# EAGLE design DRV10987 (EAGLE 8.7.1)
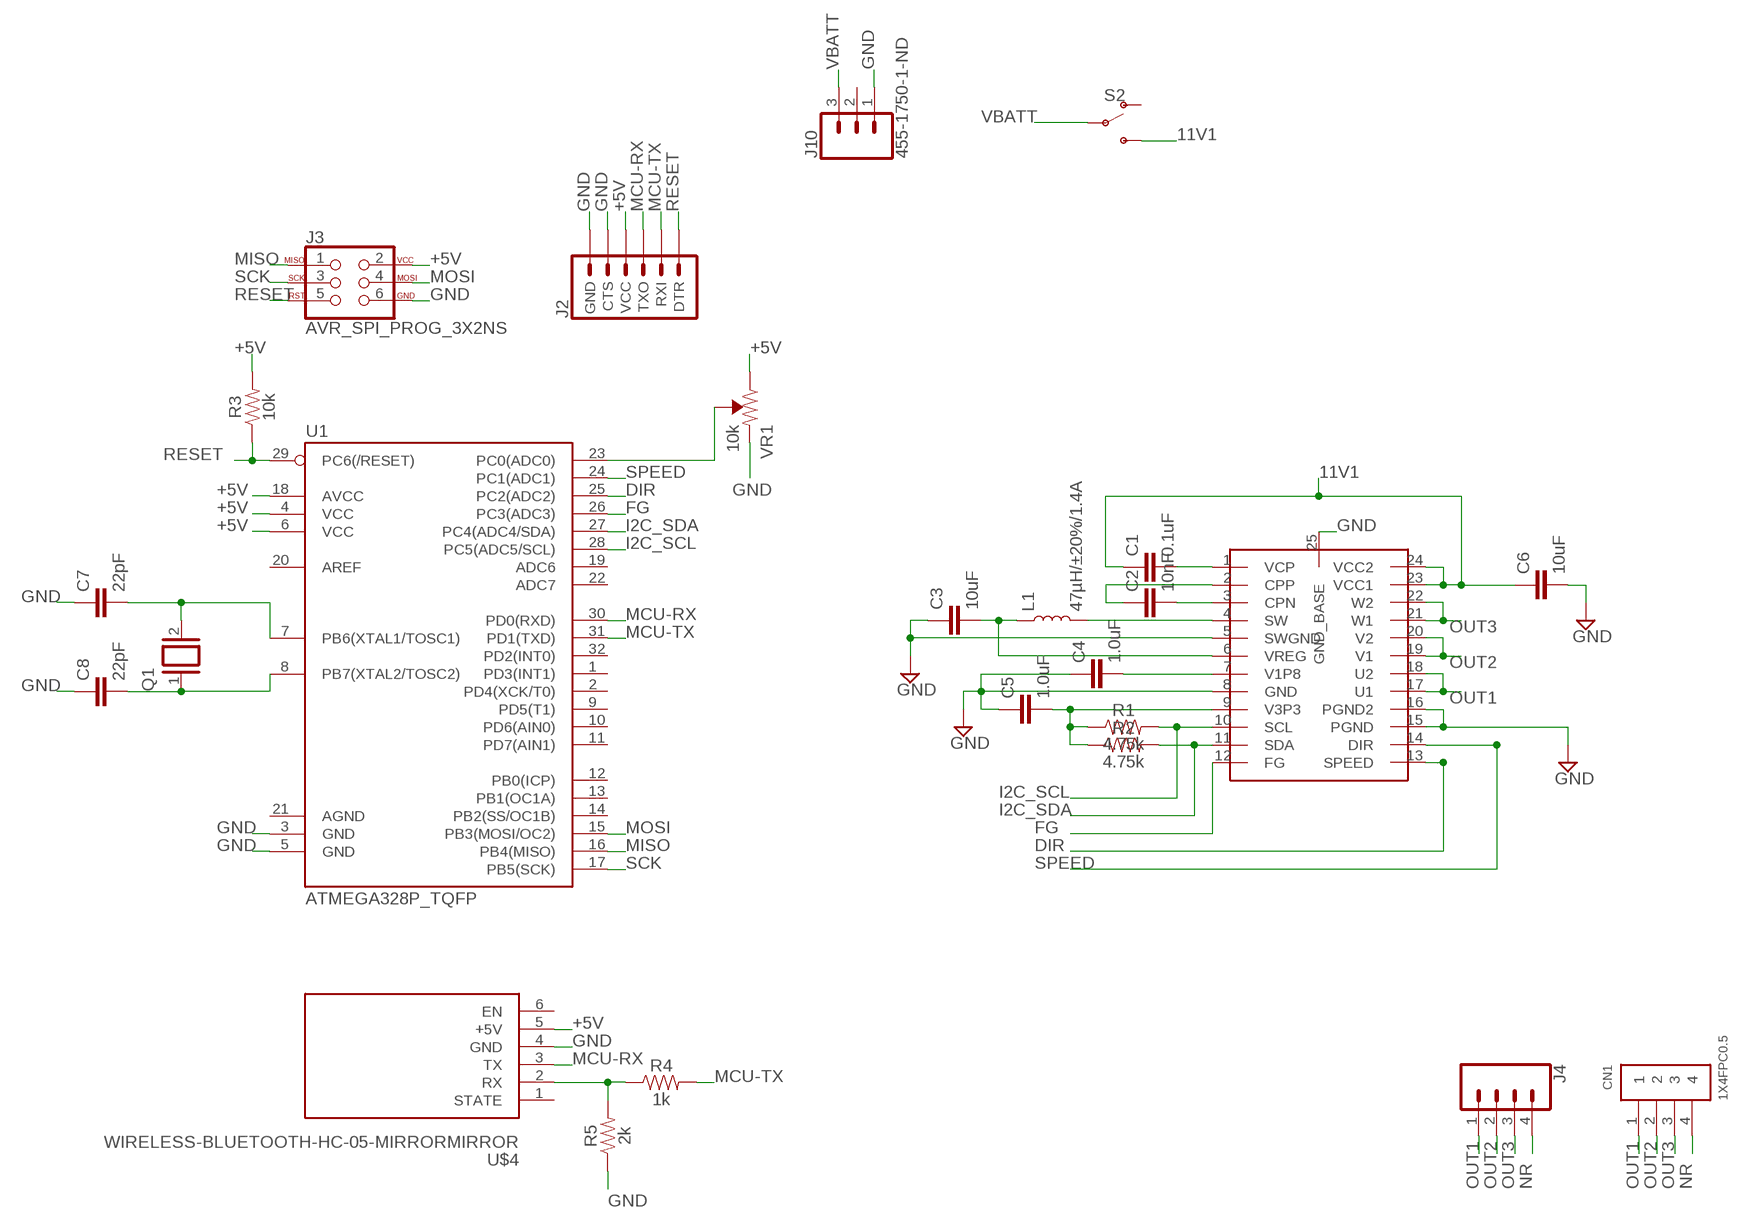
[diagram p0: schematic, sheet 1]

## Parts
C1  0.1uF  1.0UF-0805-25V-10%  [0805]
C2  10nF  1.0UF-0805-25V-10%  [0805]
C3  10uF  1.0UF-0805-25V-10%  [0805]
C4  1.0uF  1.0UF-0805-25V-10%  [0805]
C5  1.0uF  1.0UF-0805-25V-10%  [0805]
C6  10uF  1.0UF-0805-25V-10%  [0805]
C7  22pF  2.2UF-1206-50V-10%  [1206]
C8  22pF  2.2UF-1206-50V-10%  [1206]
CN1  1X4FPC0.5  [FPC_0.5MM-4]
J2  6_PIN_SERIAL_TARGET  [1X06]
J3  AVR_SPI_PROG_3X2NS  [2X3-NS]
J4  CONN_04  [1X04]
J10  455-1750-1-ND  CONN_03  [1X03]
L1  47µH/±20%/1.4A  INDUCTOR-SRN6045-33UH  [SRN6045]
Q1  XTAL/S  [QS]
R1  4.75k  RESISTOR0805  [0805]
R2  4.75k  RESISTOR0805  [0805]
R3  10k  RESISTOR1206  [1206]
R4  1k  1KOHM-HORIZ-1/4W-5%  [AXIAL-0.3]
R5  2k  RESISTORAXIAL-0.3  [AXIAL-0.3]
S2  SWITCH-SPDT-PTH-11.6X4.0MM  [SWITCH_SPDT_PTH_11.6X4.0MM]
U1  ATMEGA328P_TQFP  [TQFP32-08]
U$1  DRV10987  [DRV10987]
U$4  WIRELESS-BLUETOOTH-HC-05-MIRRORMIRROR  [WIRELESS-BLUETOOTH-HC-05-MIRROR]
VR1  10k  TRIMPOT-PTH-10MM-KNOB-1/2W-10%  [TRIMPOT-PTH-3386U]

## Nets
11V1: C1.1 C6.1 S2.3(S) U$1.23(VCC1) U$1.24(VCC2)
+5V: J2.4(VCC) J3.2 R3.2 U1.4(VCC) U1.6(VCC) U1.18(AVCC) U$4.5(+5V) VR1.3(CW)
DIR: U1.25(PC2(ADC2)) U$1.13(SPEED)
FG: U1.26(PC3(ADC3)) U$1.12(FG)
GND: C3.1 C4.1 C5.1 C6.2 C7.1 C8.1 J2.5(CTS) J2.6(GND) J3.6 J10.1 R5.P$1 U1.3(GND) U1.5(GND) U$1.5(SWGND) U$1.8(GND) U$1.15(PGND) U$1.16(PGND2) U$1.25(GND_BASE) U$4.4(GND) VR1.1(CCW)
I2C_SCL: R1.2 U1.28(PC5(ADC5/SCL)) U$1.10(SCL)
I2C_SDA: R2.2 U1.27(PC4(ADC4/SDA)) U$1.11(SDA)
MCU-RX: J2.3(TXO) U1.30(PD0(RXD)) U$4.3(TX)
MCU-TX: J2.2(RXI) R4.P$2 U1.31(PD1(TXD))
MISO: J3.1 U1.16(PB4(MISO))
MOSI: J3.4 U1.15(PB3(MOSI/OC2))
N$1: C1.2 U$1.1(VCP)
N$2: C2.1 U$1.2(CPP)
N$3: C2.2 U$1.3(CPN)
N$4: L1.2 U$1.4(SW)
N$6: C3.2 L1.1 U$1.6(VREG)
N$7: C4.2 U$1.7(V1P8)
N$8: C7.2 Q1.2 U1.7(PB6(XTAL1/TOSC1))
N$9: C5.2 R1.1 R2.1 U$1.9(V3P3)
N$10: C8.2 Q1.1 U1.8(PB7(XTAL2/TOSC2))
N$13: R4.P$1 R5.P$2 U$4.2(RX)
N$14: U1.23(PC0(ADC0)) VR1.2(WIPER)
NR: CN1.4 J4.4
OUT1: CN1.1 J4.1 U$1.17(U1) U$1.18(U2)
OUT2: CN1.2 J4.2 U$1.19(V1) U$1.20(V2)
OUT3: CN1.3 J4.3 U$1.21(W1) U$1.22(W2)
RESET: J2.1(DTR) J3.5 R3.1 U1.29(PC6(/RESET))
SCK: J3.3 U1.17(PB5(SCK))
SPEED: U1.24(PC1(ADC1)) U$1.14(DIR)
VBATT: J10.3 S2.2(P)
Unconnected: J10.2 S2.1(O) U1.1(PD3(INT1)) U1.2(PD4(XCK/T0)) U1.9(PD5(T1)) U1.10(PD6(AIN0)) U1.11(PD7(AIN1)) U1.12(PB0(ICP)) U1.13(PB1(OC1A)) U1.14(PB2(SS/OC1B)) U1.19(ADC6) U1.20(AREF) U1.21(AGND) U1.22(ADC7) U1.32(PD2(INT0)) U$4.1(STATE) U$4.6(EN)

## Library data of the parts
C1-C3 C6 = SparkFun-Capacitors:1.0UF: 1µF ceramic capacitors A capacitor is a passive two-terminal electrical component used to store electrical energy temporarily in an electric field.; PROD_ID: CAP-08064; VALUE: 1.0uF
C4 C5 = SparkFun-Capacitors:1.0UF: 1µF ceramic capacitors A capacitor is a passive two-terminal electrical component used to store electrical energy temporarily in an electric field.; PROD_ID: CAP-08064
C7 C8 = SparkFun-Capacitors:2.2UF: 2.2µF ceramic capacitors A capacitor is a passive two-terminal electrical component used to store electrical energy temporarily in an electric field.; PROD_ID: CAP-10009; VALUE: 2.2uF
CN1 = adafruit:1X4: 4-pin connector
J2 = SparkFun-Connectors:6_PIN_SERIAL_TARGET: 6-pin header connection for use with the "FTDI BASIC" pinout - TARGET SIDE. Also known as "Arduino Serial Program Header". It is used to mate with our FTDI Basic serial programmers using the Arduino IDE. Note, this device has "TARGET" in the name. It is intended to be used on a design that contains a target micro-controller that you wish to program. The "sister" device, named "CABLE" is inteneded to be used on a design that usually lives on the end of your USB cable and prvides the converter chip (FTDI232 or FTDI231x) to commnicate serial RX/TX. You can populate with some of these: Break Away Headers - Straight <https://www.sparkfun.com/products/116> (PRT-00116) For reference (or to suit your programming needs) check out these designs: SparkFun FTDI Basic Breakout - 5V <https://www.sparkfun.com/products/9716> (DEV-09716) SparkFun FTDI Basic Breakout - 3.3V <https://www.sparkfun.com/products/9873> (DEV-09873) SparkFun FTDI SmartBasic <https://www.sparkfun.com/products/12935> (DEV-12935) SparkFun Beefy 3 - FTDI Basic Breakout <https://www.sparkfun.com/products/13746> (DEV-13746)
J3 = SparkFun-Connectors:AVR_SPI_PROG_3X2: AVR ISP 6 Pin This is the reduced ISP connector for AVR programming. Common on Arduino. This footprint will take up less PCB space and can be used with a 10-pin to 6-pin adapter such as SKU: BOB-08508 **Special note about "TEST_POINT" package. The stop mask is on the top side, so if you want your programming test points to be on the bottom of your board, make sure to place this package on the bottom side of the board. This also ensure that the orientation to program from the bottom side will be correct. SparkFun Products: SparkFun ISP Pogo Adapter <https://www.sparkfun.com/products/11591> - NS Tiny AVR Programmer <https://www.sparkfun.com/products/11801> -PTH
J4 = SparkFun-Connectors:CONN_04: Multi connection point. Often used as Generic Header-pin footprint for 0.1 inch spaced/style header connections On any of the 0.1 inch spaced packages, you can populate with these: Break Away Headers - Straight <https://www.sparkfun.com/products/116> (PRT-00116) Break Away Male Headers - Right Angle <https://www.sparkfun.com/products/553> (PRT-00553) Female Headers <https://www.sparkfun.com/products/115> (PRT-00115) Break Away Headers - Machine Pin <https://www.sparkfun.com/products/117> (PRT-00117) Break Away Female Headers - Swiss Machine Pin <https://www.sparkfun.com/products/743> (PRT-00743) For SCREWTERMINALS and SPRING TERMINALS visit here: Screw Terimnals on SparkFun.com <https://www.sparkfun.com/search/results?term=Screw+Terminals> (5mm/3.5mm/2.54mm spacing) This device is also useful as a general connection point to wire up your design to another part of your project. Our various solder wires solder well into these plated through hole pads. Hook-Up Wire - Assortment (Stranded, 22 AWG) <https://www.sparkfun.com/products/11375> (PRT-11375) Hook-Up Wire - Assortment (Solid Core, 22 AWG) <https://www.sparkfun.com/products/11367> (PRT-11367) View the entire wire category on our website here <https://www.sparkfun.com/categories/141> Special notes: Molex polarized connector foot print use with SKU : PRT-08231 with associated crimp pins and housings. 1MM SMD Version SKU: PRT-10208; PROD_ID: CONN-09696
J10 = SparkFun-Connectors:CONN_03: Multi connection point. Often used as Generic Header-pin footprint for 0.1 inch spaced/style header connections On any of the 0.1 inch spaced packages, you can populate with these: Break Away Headers - Straight <https://www.sparkfun.com/products/116> (PRT-00116) Break Away Male Headers - Right Angle <https://www.sparkfun.com/products/553> (PRT-00553) Female Headers <https://www.sparkfun.com/products/115> (PRT-00115) Break Away Headers - Machine Pin <https://www.sparkfun.com/products/117> (PRT-00117) Break Away Female Headers - Swiss Machine Pin <https://www.sparkfun.com/products/743> (PRT-00743) Stackable Header - 3 Pin (Female, 0.1") <https://www.sparkfun.com/products/13875> (PRT-13875) For SCREWTERMINALS and SPRING TERMINALS visit here: Screw Terimnals on SparkFun.com <https://www.sparkfun.com/search/results?term=Screw+Terminals> (5mm/3.5mm/2.54mm spacing) This device is also useful as a general connection point to wire up your design to another part of your project. Our various solder wires solder well into these plated through hole pads. Hook-Up Wire - Assortment (Stranded, 22 AWG) <https://www.sparkfun.com/products/11375> (PRT-11375) Hook-Up Wire - Assortment (Solid Core, 22 AWG) <https://www.sparkfun.com/products/11367> (PRT-11367) View the entire wire category on our website here <https://www.sparkfun.com/categories/141> Special notes: Molex polarized connector foot print use with SKU : PRT-08232 with associated crimp pins and housings.; PROD_ID: XXX-00000
L1 = SparkFun-Coils:INDUCTOR: Inductors Resist changes in electrical current. Basically a coil of wire. SparkFun Products: SparkFun Load Cell Amplifier - HX711 <https://www.sparkfun.com/products/13879> IOIO-OTG - V2.2 <https://www.sparkfun.com/products/13613>; PROD_ID: NDUC-11627; VALUE: 33µH/±20%/1.4A
Q1 = special:XTAL/S: CRYSTAL
R1-R3 = SparkFun-Resistors:RESISTOR: Generic Resistor Package
R4 = resistors-longpads:1KOHM: 1kΩ resistor A resistor is a passive two-terminal electrical component that implements electrical resistance as a circuit element. Resistors act to reduce current flow, and, at the same time, act to lower voltage levels within circuits. - Wikipedia; PROD_ID: RES-08380
R5 = resistors-longpads:RESISTOR: Generic Resistor Package
S2 = SparkFun-Switches:SWITCH-SPDT: Single Pole, Double Throw (SPDT) Switch Single-pole, double-throw (SPDT) switch. Variant Overview SMD-AYZ0202 Surface Mount DPDT Switch <https://www.sparkfun.com/products/597> (COM-00597) Used on e.g. LilyPad Arduino USB - ATmega32U4 Board <https://www.sparkfun.com/products/12049> PTH-11.6X4.0MM SPDT Mini Power Switch <https://www.sparkfun.com/products/102> (COM-00102) Used on e.g. SparkFun Simon Says - Through-Hole Soldering Kit <https://www.sparkfun.com/products/10547> (KIT-10547) PTH-11.6X4.0MM-KIT KIT version of SPDT Mini Power Switch - Simplifies soldering by removing tStop of switch pins - only one side can be soldered. PTH-11.6X4.0MM-LOCK LOCK version of SPDT Mini Power Switch - Offset pins hold switch in place for easier soldering. SMD-RIGHT-ANGLE Surface Mount Right Angle Switch <https://www.sparkfun.com/products/10860> (COM-10860) Used on e.g. SparkFun ESP8266 Thing <https://www.sparkfun.com/products/13231>; PROD_ID: SWCH-08261; SF_SKU: COM-00102
U1 = SparkFun-IC-Microcontroller:ATMEGA328P_TQFP: Popular 328P in QFP Storefront component: ATmega328 - TQFP <https://www.sparkfun.com/products/13448> (COM-13448) Datasheet <http://www.sparkfun.com/datasheets/Components/SMD/ATMega328.pdf> SparkFun Products SparkFun RedBoard - Programmed with Arduino <https://www.sparkfun.com/products/12757> (DEV-12757) Arduino Pro Mini 328 - 5V/16MHz <https://www.sparkfun.com/products/11113> (DEV-11113) Arduino Pro Mini 328 - 3.3V/8MHz <https://www.sparkfun.com/products/11114> (DEV-11114) SparkFun OpenLog <https://www.sparkfun.com/products/13712> (DEV-13712) SparkFun MicroView - OLED Arduino Module <https://www.sparkfun.com/products/12923> (DEV-12923) SparkFun Digital Sandbox <https://www.sparkfun.com/products/12651> (DEV-12651) SparkFun PicoBoard <https://www.sparkfun.com/products/11888> (WIG-11888) Arduino Fio <https://www.sparkfun.com/products/10116> (DEV-10116) LilyPad Arduino 328 Main Board <https://www.sparkfun.com/products/13342> (DEV-13342) SparkFun RedStick <https://www.sparkfun.com/products/13741> (DEV-13741) LilyPad MP3 <https://www.sparkfun.com/products/11013> (DEV-11013) LilyPad Arduino SimpleSnap <https://www.sparkfun.com/products/10941> (DEV-10941) SparkFun Stepoko <https://www.sparkfun.com/products/13899> (ROB-13899) SparkFun Geiger Counter <https://www.sparkfun.com/products/11345> (SEN-11345) SparkFun EL Sequencer <https://www.sparkfun.com/products/12781> (COM-12781) Arduino Pro 328 - 5V/16MHz <https://www.sparkfun.com/products/10915> (DEV-10915) CryptoCape <https://www.sparkfun.com/products/12773> (DEV-12773) SparkFun IR Thermometer Evaluation Board - MLX90614 <https://www.sparkfun.com/products/10740> (SEN-10740) SparkFun RedBot Mainboard <https://www.sparkfun.com/products/12097> (ROB-12097) Arduino Pro 328 - 3.3V/8MHz <https://www.sparkfun.com/products/10914> (DEV-10914) SparkFun Block for Intel® Edison - Arduino <https://www.sparkfun.com/products/13036> (DEV-13036) SparkFun Simon Says - Surface Mount Soldering Kit <https://www.sparkfun.com/products/10935> (KIT-10935) SparkFun 7-Segment Serial Display - Red <https://www.sparkfun.com/products/11441> (COM-11441) SparkFun 7-Segment Serial Display - White <https://www.sparkfun.com/products/11629> (COM-11629) SparkFun 7-Segment Serial Display - Yellow <https://www.sparkfun.com/products/11443> (COM-11443) SparkFun 7-Segment Serial Display - Kelly Green <https://www.sparkfun.com/products/11440> (COM-11440) SparkFun 7-Segment Serial Display - Blue <https://www.sparkfun.com/products/11442> (COM-11442) SparkFun OpenSegment Serial Display - 20mm (Blue) <https://www.sparkfun.com/products/11647> (COM-11647) SparkFun OpenSegment Serial Display - 20mm (Green) <https://www.sparkfun.com/products/11646> (COM-11646) SparkFun OpenSegment Serial Display - 20mm (White) <https://www.sparkfun.com/products/11648> (COM-11648) SparkFun OpenSegment Serial Display - 20mm (Red) <https://www.sparkfun.com/products/11644> (COM-11644) SparkFun OpenSegment Serial Display - 20mm (Yellow) <https://www.sparkfun.com/products/11645> (COM-11645) SparkFun OpenSegment Shield <https://www.sparkfun.com/products/13190> (DEV-13190); PROD_ID: IC-09069
U$1 = BLDC_DRIVER:DRV10987
U$4 = diy-modules:WIRELESS-BLUETOOTH-HC-05-MIRROR: Bluetooth Transceiver Module based on HC-05 board Tutorial is available here: https://arduino-info.wikispaces.com/BlueTooth-HC05-HC06-Modules-How-To Click here to find device on ebay.com <http://www.ebay.com/sch/hc-05+module+rs232>
VR1 = SparkFun-Resistors:TRIMPOT: Trimming Potentiometer (Trimpot) Three-terminal potentiometers, with an adjustable wiper and two adjustable resistors. A pot can be used to create a configurable voltage divider, or as a variable resistor. "Trimpots" are a subset of potentiometers, usually intended for "set-and-forget" applications. They're often more delicate than standard potentiometers - rated for fewer turns. Variants PTH-KNOB - PTH Trimpot w/ finger-adjustable knob Trimpot 10K with Knob <https://www.sparkfun.com/products/9806> (COM-09806) Datasheet <http://www.sprkfun.com/datasheets/Components/General/TSR-3386.pdf> SMD-3MM-CLOSED-FRAME - SMD 3mm Square Closed-Frame Trimpot Used on e.g. EasyDriver - Stepper Motor Driver <https://www.sparkfun.com/products/12779> Datasheet <http://www.bitechnologies.com/pdfs/22.pdf> (22AR10KTR) SMD-5MM - SMD 5mm Square Closed-Frame Trimpot Used on e.g. IOIO-OTG - V2.2 <https://www.sparkfun.com/products/13613> Datasheet <http://www.vishay.com/docs/51008/ts53.pdf> (TS53YL502MR10) SMD-3MM-1/10W-25% - 3mm Square Open-Frame Trimpot Used on e.g. SparkFun Shapeoko <https://www.sparkfun.com/products/13899> Datasheet <http://www.bourns.com/docs/Product-Datasheets/TC33.pdf> (TC33X-2-103E); PROD_ID: RES-09730; SF_SKU: COM-09806

## Board
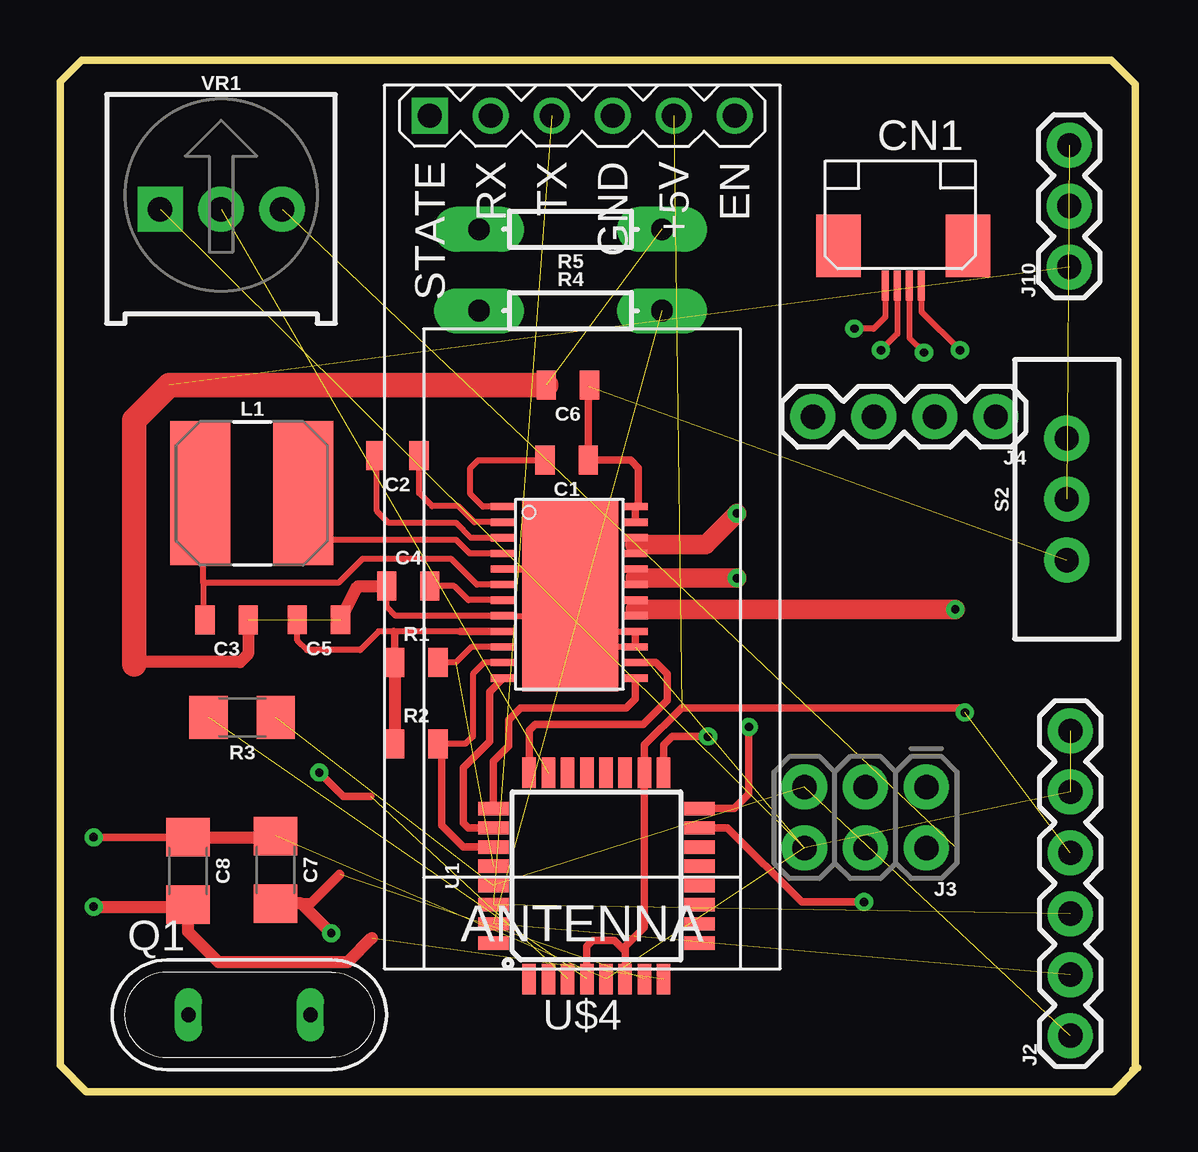
[diagram p1: board, top side]
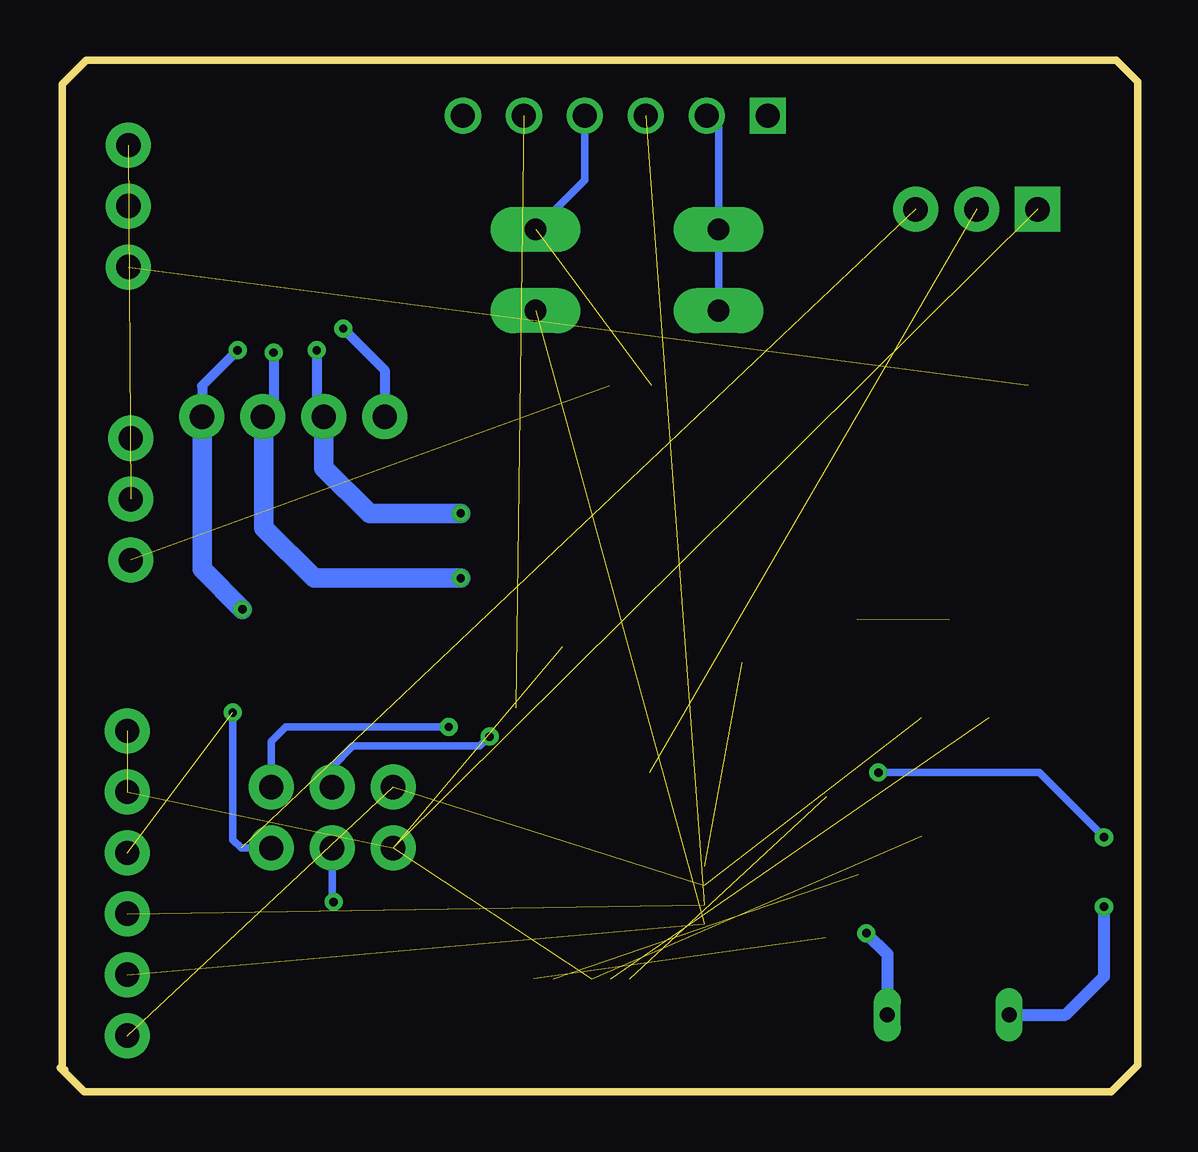
[diagram p2: board, bottom side, seen from below]

Size 44.9 x 43 mm. Coordinates in mm from the lower left corner, seen from the top.
Outline: 44.8,0.9 43.9,0 1.1,0 0,1.1 0,42.1 0.9,43 43.8,43 44.8,42 44.8,1 44.7,0.9 44.8,0.9
Outline: 44.9,1 44.8,0.9
Copper layers (1*16): Top 0.035mm / dielectric 1.5mm / Bottom 0.035mm
Design rules "default": minimum track width 6mil, minimum drill 0.35mm, track to track 6mil, track to pad 6mil, pad to pad 6mil, via to via 6mil, smd to smd 6mil, copper to edge 40mil, drill to drill 6mil, minimum pad ring 10mil, minimum via ring 8mil, stop-mask expansion 4mil, vias tented up to drill 0mil, thermal gap 10mil

### Footprints (pad centres in the part's own frame; a part is rotated, then mirrored left to right if it is on the bottom)
0805 = smd 0.8 x 1.2: 1 -0.9,0; 2 0.9,0
1206 = smd 1.6 x 1.8: 1 -1.4,0; 2 1.4,0
FPC_0.5MM-4 = smd 0.3 x 1.25: 1 -0.75,-0.45; 2 -0.25,-0.45; 3 0.25,-0.45; 4 0.75,-0.45 | smd 1.85 x 2.6: MT -2.7,-2.1; MT2 2.7,-2.1
1X06 = drill 1.016 pad 1.88: 1 0,0; 2 2.54,0; 3 5.08,0; 4 7.62,0; 5 10.16,0; 6 12.7,0
2X3-NS = drill 1.016 pad 1.88: 1 -2.54,-1.27; 2 -2.54,1.27; 3 0,-1.27; 4 0,1.27; 5 2.54,-1.27; 6 2.54,1.27
1X04 = drill 1.016 pad 1.88: 1 0,0; 2 2.54,0; 3 5.08,0; 4 7.62,0
1X03 = drill 1.016 pad 1.88: 1 0,0; 2 2.54,0; 3 5.08,0
SRN6045 = smd 2.5 x 6: 1 -2.175,0; 2 2.125,0
QS = drill 0.61 long: 1 -2.54,0; 2 2.54,0
AXIAL-0.3 = drill 0.9 pad 1.88 long: P$1 -3.81,0; P$2 3.81,0
SWITCH_SPDT_PTH_11.6X4.0MM = drill 1.016 pad 1.88: 1 0,2.54; 2 0,0; 3 0,-2.54
TQFP32-08 = smd 1.27 x 0.559: 1 -4.293,2.8; 2 -4.293,2; 3 -4.293,1.2; 4 -4.293,0.4; 5 -4.293,-0.4; 6 -4.293,-1.2; 7 -4.293,-2; 8 -4.293,-2.8; 17 4.293,-2.8; 18 4.293,-2; 19 4.293,-1.2; 20 4.293,-0.4; 21 4.293,0.4; 22 4.293,1.2; 23 4.293,2; 24 4.293,2.8 | smd 0.559 x 1.27: 9 -2.8,-4.293; 10 -2,-4.293; 11 -1.2,-4.293; 12 -0.4,-4.293; 13 0.4,-4.293; 14 1.2,-4.293; 15 2,-4.293; 16 2.8,-4.293; 25 2.8,4.293; 26 2,4.293; 27 1.2,4.293; 28 0.4,4.293; 29 -0.4,4.293; 30 -1.2,4.293; 31 -2,4.293; 32 -2.8,4.293
DRV10987 = smd 0.3 x 1.05: 1 0.3,-0.5; 2 0.95,-0.5; 3 1.6,-0.5; 4 2.25,-0.5; 5 2.9,-0.5; 6 3.55,-0.5; 7 4.2,-0.5; 8 4.85,-0.5; 9 5.5,-0.5; 10 6.15,-0.5; 11 6.8,-0.5; 12 7.45,-0.5; 13 7.45,5; 14 6.8,5; 15 6.15,5; 16 5.5,5; 17 4.85,5; 18 4.2,5; 19 3.55,5; 20 2.9,5; 21 2.25,4.98; 22 1.6,5; 23 0.95,5; 24 0.3,5 | smd 8 x 4: 25 4,2.3
WIRELESS-BLUETOOTH-HC-05-MIRROR = drill 1 square: 1 6.35,-17.145 | drill 1: 2 3.81,-17.145; 3 1.27,-17.145; 4 -1.27,-17.145; 5 -3.81,-17.145; 6 -6.35,-17.145
TRIMPOT-PTH-3386U = drill 1.016 pad 1.88 square: 1 -2.54,-0.015 | drill 1.016 pad 1.88: 2 0,-0.015; 3 2.54,-0.015

### Placement (x,y rotation side)
C1  21.11,26.32 180 top
C2  14.06,26.51 180 top
C3  6.94,19.66 180 top
C4  14.51,21.07 0 top
C5  10.79,19.67 180 top
C6  21.16,29.45 180 top
C7  8.98,9.24 270 top
C8  5.33,9.2 270 top
CN1  35.14,33.15 180 top
J2  42.1,2.33 90 top
J3  33.56,11.42 180 top
J4  38.99,28.13 180 top
J10  42.05,34.37 90 top
L1  8.01,24.94 0 top
Q1  7.89,3.2 0 top
R1  14.85,17.89 0 top
R2  14.85,14.49 0 top
R3  7.59,15.59 180 top
R4  21.27,32.55 0 top
R5  21.27,35.94 180 top
S2  41.95,24.69 0 top
U1  22.35,8.99 90 top
U$1  18.97,24.68 270 top
U$4  21.76,23.53 180 top
VR1  6.71,36.79 0 top

### Tracks (layer width: path | path; a pad name or v marks a point on that pad's centre or on a via)
11V1  (1 unrouted)
  Top 0.305: U$1.23 U$1.24 24.1,24.51 24.1,26 23.78,26.32 C1.1 22.01,29.4 C6.1
+5V  (via drill 0.35)  (4 unrouted)
  Top 0.305: 37.7,16.04 v37.7,15.8 37.5,16 25.9,16 24.35,14.45 U1.18 24.35,6.85 23.55,6.05 23.55,5.85 | U1.4 21.95,6.05 22.2,6.3 23.1,6.3 23.55,5.85 | 23.55,5.85 U1.6
  Bottom 0.305: v37.7,15.8 37.7,10.5 37.35,10.15 J3.2
DIR
  Top 0.305: U$1.13 23.97,16.37 23.6,16 19.2,16 18.7,15.5 18.7,14.4 18.06,13.76 U1.25
FG
  Top 0.305: 18.47,17.2 U$1.12 17.9,16.66 17.9,14.6 16.8,13.5 16.8,11.2 17.01,10.99 U1.26
GND  (via drill 0.35)  (10 unrouted)
  Top 0.254: U$1.15 22.83,18.53 | 22.83,18.53 22.8,18.5 | 22.83,18.53 22.9,18.6 | U$1.16 22.77,19.18 U$1.25 20.39,19.8 20.1,19.8 19.5,19.8 19.47,19.83 U$1.8 13.97,19.83 13.61,20.19 C4.1
  Top 0.305: 20.6,19.59 20.39,19.8 | 20,19.9 20.1,19.8 | U$1.15 U$1.16 | U$1.5 20.17,21.78 U$1.25 | 12.95,12.3 11.8,12.3 v10.8,13.3 | v1.4,10.6 C8.1
  Top 0.508: C5.1 12.41,21.07 C4.1 | C3.1 7.84,18.24 7.5,17.9 3.2,17.9 3.1,17.8 | C8.1 8.94,10.6 C7.1
  Top 1.016: C6.2 4.55,29.45 3.1,28 3.1,17.8
  Bottom 0.305: R5.P$1 23.03,37.99 U$4.4 | v10.8,13.3 4.1,13.3 v1.4,10.6
I2C_SCL  (1 unrouted)
  Top 0.254: U$1.10 17.13,18.53 16.49,17.89 R1.2
I2C_SDA
  Top 0.254: U$1.11 17.68,17.88 17.2,17.4 17.2,14.8 16.89,14.49 R2.2
  Top 0.305: U1.27 16.81,10.19 15.9,11.1 15.9,14.34 R2.2
MCU-RX  (2 unrouted)
MCU-TX  (2 unrouted)
MISO  (via drill 0.35)
  Top 0.305: U1.16 26.65,11.8 28.1,11.8 28.7,12.4 v28.7,15.2
  Bottom 0.305: v28.7,15.2 35.5,15.2 36.1,14.6 J3.1
MOSI  (via drill 0.35)
  Top 0.305: v33.5,7.9 30.9,7.9 27.81,10.99 U1.15
  Bottom 0.305: J3.4 33.56,7.96 v33.5,7.9
N$1
  Top 0.254: U$1.1 17.62,24.38 17.1,24.9 17.1,26 17.42,26.32 C1.2
N$2
  Top 0.254: U$1.2 17.27,23.73 16.6,24.4 15.5,24.4 14.96,24.94 C2.1
N$3
  Top 0.254: U$1.3 17.12,23.08 16.5,23.7 13.7,23.7 13.2,24.2 13.2,26.47 C2.2
N$4
  Top 0.254: U$1.4 17.07,22.43 16.5,23 10.8,23 10.4,23.4
  Top 0.305: L1.2 10.14,23.66 10.4,23.4
N$6
  Top 0.254: U$1.6 17.37,21.13 16.3,22.2 12.6,22.2 11.6,21.2 5.96,21.2 | 5.96,21.2 5.96,23.2 | 5.96,21.2 5.96,19.74 C3.2
  Top 0.305: 6,22.68 5.96,23.2 5.87,24.5 L1.1
N$7
  Top 0.254: U$1.7 17.02,20.48 16.43,21.07 C4.2
N$8  (via drill 0.35)  (1 unrouted)
  Top 0.406: C7.2 9.1,7.84 10.44,7.84 11.65,9.05
  Top 0.508: v11.3,6.6 10.06,7.84 9.1,7.84
  Bottom 0.508: v11.3,6.6 10.43,5.73 Q1.2
N$9
  Top 0.254: 16.68,19.18 13.9,19.18 13.28,19.18 12.5,18.4 10.3,18.4 9.89,18.81 C5.2
  Top 0.305: U$1.9 16.68,19.18 | R1.1 13.95,19.13 13.9,19.18
  Top 0.508: R1.1 R2.1
N$10  (via drill 0.35)  (1 unrouted)
  Top 0.508: v1.4,7.7 5.27,7.7 5.35,7.78 C8.2 5.33,6.67 6.6,5.4 12,5.4 13,6.4
  Bottom 0.508: Q1.1 3,3.2 1.4,4.8 v1.4,7.7
N$13
  Bottom 0.305: U$4.2 17.46,40.19 R5.P$2 R4.P$1
N$14  (1 unrouted)
NR  (via drill 0.35)
  Top 0.254: CN1.4 34.39,32.29 33.9,31.8 v33.1,31.8
  Bottom 0.254: 31.37,28.93 31.37,28.3 J4.4
  Bottom 0.406: v33.1,31.8 31.37,30.07 31.37,28.3
OUT1  (via drill 0.35)
  Top 0.254: CN1.1 35.89,32.51 v37.5,30.9
  Top 0.305: U$1.17 23.97,20.1 U$1.18
  Top 0.813: 23.97,20.1 v37.3,20.1
  Bottom 0.406: v37.5,30.9 38.98,29.42 J4.1
  Bottom 0.813: v37.3,20.1 38.98,21.78 J4.1
  Bottom 1.27: J4.1
OUT2  (via drill 0.35)
  Top 0.254: CN1.2 35.39,31.41 v36,30.8
  Top 0.305: U$1.19 23.97,21.4 U$1.20
  Top 0.813: 23.97,21.4 v28.2,21.4
  Bottom 0.406: v36,30.8 36,28.34 36.33,28.01
  Bottom 0.813: v28.2,21.4 34.3,21.4 36.4,23.5 36.4,27.94 36.33,28.01
  Bottom 1.27: 36.33,28.01 J4.2
OUT3  (via drill 0.35)
  Top 0.254: CN1.3 34.89,31.59 v34.2,30.9
  Top 0.305: 23.97,22.45 U$1.21 23.95,22.8 23.95,23.06 U$1.22
  Top 0.813: 23.95,22.8 26.9,22.8 v28.2,24.1
  Bottom 0.406: v34.2,30.9 34.2,28.24 34,28.04
  Bottom 0.813: v28.2,24.1 32,24.1 33.9,26 J4.3
  Bottom 1.27: 34,28.04 J4.3
RESET  (3 unrouted)
SCK  (via drill 0.35)
  Top 0.305: U1.17 25.15,14.45 25.5,14.8 v27,14.8
  Bottom 0.305: v27,14.8 27.4,14.4 32.7,14.4 33.56,13.54 J3.3
SPEED
  Top 0.305: U$1.14 24.82,17.88 25.3,17.4 25.3,16.3 24.3,15.3 19.8,15.3 19.55,15.05 U1.24
VBATT  (1 unrouted)